# EAGLE design usbrelay (EAGLE 6.0)
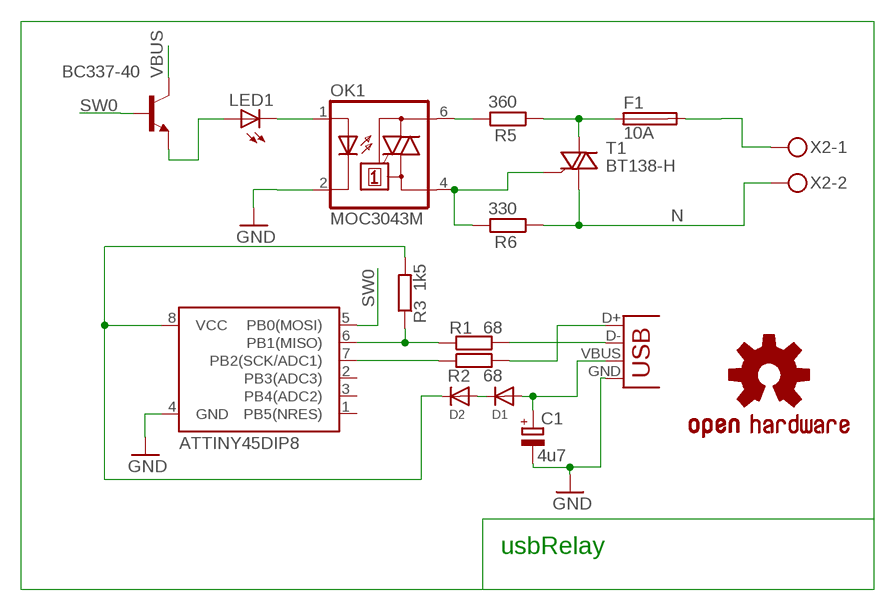
[diagram p0: schematic, sheet 1]

## Parts
C1  4u7  CPOL-EUE5-4  [E5-4]
D1  DIODEDO-1N4148  [DO-1N4148]
D2  DIODEDO-1N4148  [DO-1N4148]
F1  10A  FUSEBLANK_5X20MM  [FUSE_HOLDER_5X20MM]
LED1  LED3MM  [LED3MM]
OK1  MOC3043M  [DIL06]
Q1  BC337-40  [TO92]
R1  68  R-EU_0204/5  [0204/5]
R2  68  R-EU_0204/5  [0204/5]
R3  1k5  R-EU_0204/5  [0204/5]
R5  360  R-EU_0204/5  [0204/5]
R6  330  R-EU_0204/5  [0204/5]
T1  BT138-H  [TO220BH]
U$1  ATTINY45DIP8  [DIP08]
U$2  OSHW-LOGOM  [OSHW-LOGO-M]
X1  USBPTH  [USB-B-PTH]
X2  MKDSN1,5/2-5,08  [MKDSN1,5/2-5,08]

## Nets
GND: C1.- U$1.4(GND) X1.GND
N [hw]: R6.1 T1.T1(A1) X2.2
N$1: D1.C D2.A
N$2: R1.2 X1.D-
N$3: R1.1 R3.1 U$1.6(PB1(MISO))
N$4: R2.2 X1.D+
N$6: R2.1 U$1.7(PB2(SCK/ADC1))
N$7: LED1.A Q1.1(E)
N$8: D2.C R3.2 U$1.8(VCC)
N$9: Q1.2(B)
N$14: LED1.K(C) OK1.1(A)
N$17: OK1.2(C)
N$18 [hw]: OK1.6(A2) R5.2
N$20 [hw]: F1.1 R5.1 T1.T2(A2)
N$21 [hw]: OK1.4(A1) R6.2 T1.G
N$24 [hw]: F1.2 X2.1
SW0: U$1.5(PB0(MOSI))
VBUS: C1.+ D1.A Q1.3(C) X1.VBUS
Unconnected: U$1.1(PB5(NRES)) U$1.2(PB3(ADC3)) U$1.3(PB4(ADC2))

## Notes on the sheet
- usbRelay

## Library data of the parts
C1 = resistor:CPOL-EU: POLARIZED CAPACITOR, European symbol
D1 D2 = adafruit:DIODE: Diode SMADIODE - SMA Surface Mount Package 20V 1A Schottky Diode Digikey: 641-1014-6-ND DO-1N4148 - Through Hole Small Current Diode SOD-123 20V 1 A (.5mV Vf) Schottky Diode - Digikey: MBRX120TPMSCT-ND SOD-323 10V 570mA (.38mV Vf, 3ns) Schottky Diode - Digikey: ZLLS410CT-ND SOD-523 30V 30mA Schottky Diode (RB751S-40TE61) - Digikey: RB751S-40TE61CT-ND SOT23-R/W - SOT23 Package (R = Solder Paste/Reflow Ovens, W = Hand-Soldering) BAT54Film 40V 300mA - Digikey: 497-7162-1-ND
F1 = fuse:FUSE: Fuse
LED1 = adafruit:LED: LED OSRAM: - CHIPLED LG R971, LG N971, LY N971, LG Q971, LY Q971, LO R971, LY R971 LH N974, LH R974 LS Q976, LO Q976, LY Q976 LO Q996 - Hyper CHIPLED LW Q18S LB Q993, LB Q99A, LB R99A - SideLED LS A670, LO A670, LY A670, LG A670, LP A670 LB A673, LV A673, LT A673, LW A673 LH A674 LY A675 LS A676, LA A676, LO A676, LY A676, LW A676 LS A679, LY A679, LG A679 - Hyper Micro SIDELED® LS Y876, LA Y876, LO Y876, LY Y876 LT Y87S - SmartLED LW L88C, LW L88S LB L89C, LB L89S, LG L890 LS L89K, LO L89K, LY L89K LS L896, LA L896, LO L896, LY L896 - TOPLED LS T670, LO T670, LY T670, LG T670, LP T670 LSG T670, LSP T670, LSY T670, LOP T670, LYG T670 LG T671, LOG T671, LSG T671 LB T673, LV T673, LT T673, LW T673 LH T674 LS T676, LA T676, LO T676, LY T676, LB T676, LH T676, LSB T676, LW T676 LB T67C, LV T67C, LT T67C, LS T67K, LO T67K, LY T67K, LW E67C LS E67B, LA E67B, LO E67B, LY E67B, LB E67C, LV E67C, LT E67C LW T67C LS T679, LY T679, LG T679 LS T770, LO T770, LY T770, LG T770, LP T770 LB T773, LV T773, LT T773, LW T773 LH T774 LS E675, LA E675, LY E675, LS T675 LS T776, LA T776, LO T776, LY T776, LB T776 LHGB T686 LT T68C, LB T68C - Hyper Mini TOPLED® LB M676 - Mini TOPLED Santana® LG M470 LS M47K, LO M47K, LY M47K Source: http://www.osram.convergy.de/
OK1 = optocoupler:MOC30*: 6-Pin DIP Zero-Cross Optoisolators Triac Driver Output (250/400 Volt Peak) Source: http://www.fairchildsemi.com/ds/MO/MOC3043-M.pdf
Q1 = transistor-npn:BC337*: NPN Transistor
R1-R3 R5 R6 = resistor:R-EU_: RESISTOR, European symbol
T1 = triac:BT138: TRIAC Source: http://www.semiconductors.philips.com BT138_SERIES_2.pdf
U$1 = SparkFun:ATTINY45: Atmel ATTiny45
U$2 = SparkFun:OSHW-LOGO: Open Source Hardware Logo This logo indicates the piece of hardware it is found on incorporates a OSHW license and/or adheres to the definition of open source hardware found here: http://freedomdefined.org/OSHW
X1 = SparkFun:USB: USB Connectors USB-B-PTH is fully proven SKU : PRT-00139 USB-miniB is fully proven SKU : PRT-00587 USB-A-PCB is untested. USB-A-H is throughly reviewed, but untested. Spark Fun Electronics SKU : PRT-00437 USB-B-SMT is throughly reviewed, but untested. Needs silkscreen touching up. USB-A-S has not been used/tested USB-MB-H has not been used/tested
X2 = con-phoenix-508:MKDSN1,5/2-5,08: MKDSN 1,5/ 2-5,08 Printklemme Nennstrom: 13,5 A Nennspannung: 250 V Rastermaß: 5,08 mm Polzahl: 2 Anschlussart: Schraubanschluss Montage: Löten Anschlussrichtung Leiter/Platine: 0 ° Artikelnummer: 1729128 Source: http://eshop.phoenixcontact.com .. 1729128.pdf; MPN: MKDSN 1,5/2-5.08; OC_FARNELL: 1792903; OC_NEWARK: 30M2397

## Net classes
0 default: width 0.3 mm
1 hw: width 1.5 mm

## Board
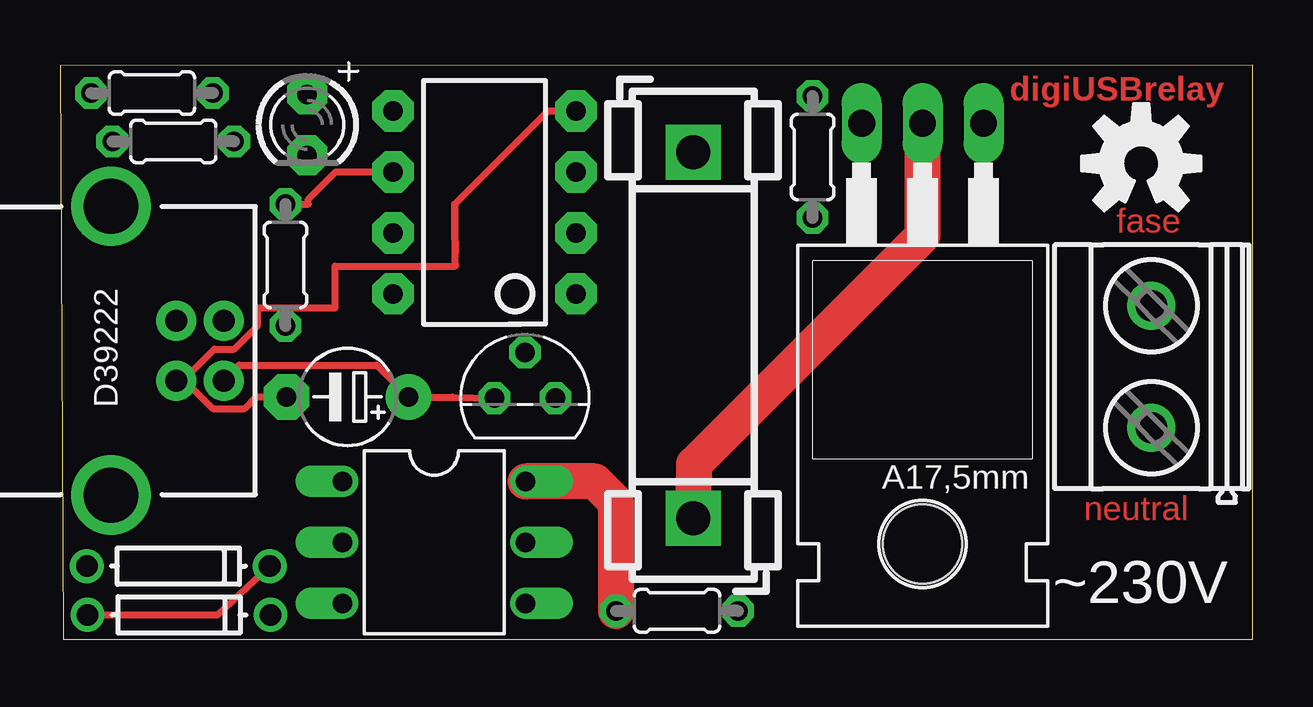
[diagram p1: board, top side]
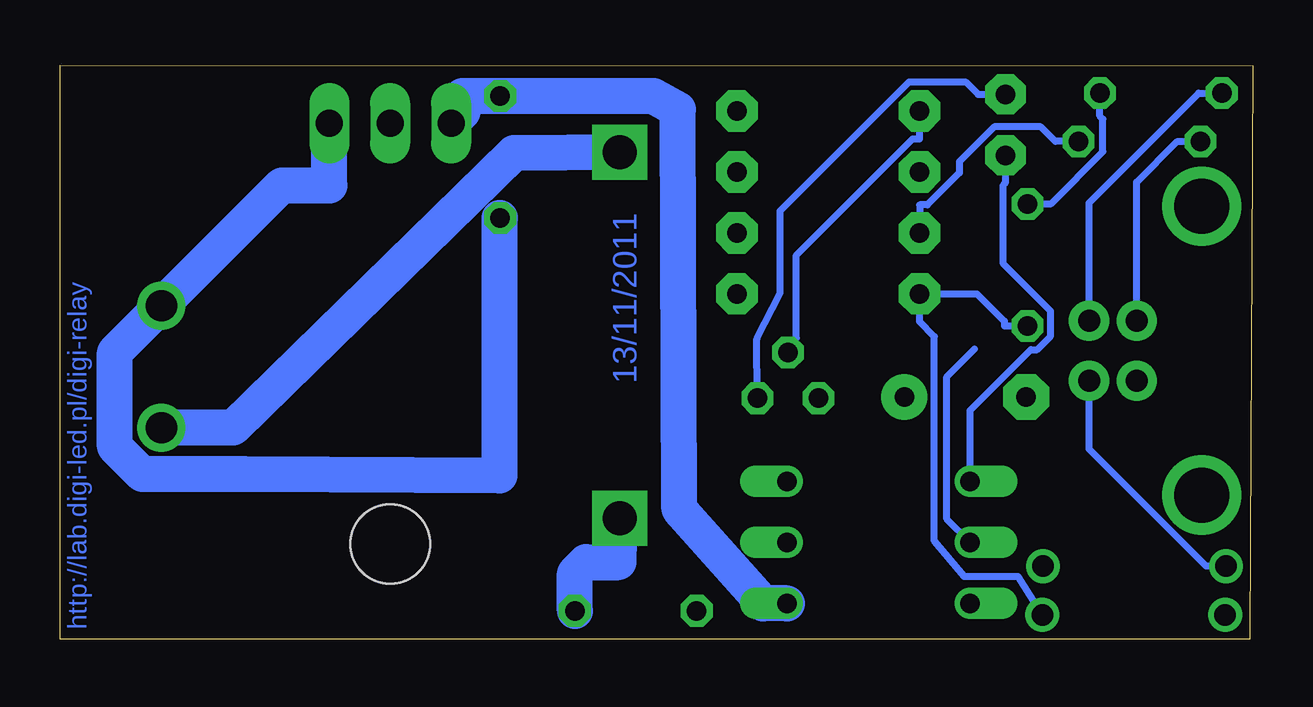
[diagram p2: board, bottom side, seen from below]

Size 49.7 x 23.91 mm. Coordinates in mm from the lower left corner, seen from the top.
Outline: 0.13,0 49.7,0 49.7,23.91 0,23.89 0.13,0
Copper layers (1*16): Top 0.035mm / dielectric 1.5mm / Bottom 0.035mm
Design rules: minimum track width 6mil, minimum drill 12mil, track to track 6mil, track to pad 6mil, pad to pad 6mil, via to via 6mil, smd to smd 0mil, copper to edge 10mil, drill to drill 10mil, minimum pad ring 10mil, minimum via ring 6mil, stop-mask expansion 2mil, vias tented up to drill 100mil, thermal gap 10mil

### Footprints (pad centres in the part's own frame; a part is rotated, then mirrored left to right if it is on the bottom)
E5-4 = drill 0.813 pad 1.905: + -2.54,0 | drill 0.813 pad 1.905 octagon: - 2.54,0
DO-1N4148 = drill 0.9: A -3.81,0; C 3.81,0
FUSE_HOLDER_5X20MM = drill 1.422 pad 2.286 square: 1 0,0; 2 15.24,0
LED3MM = drill 0.813 pad 1.676 octagon: A -1.27,0; K 1.27,0
DIL06 = drill 0.813 offset: 1 -2.54,-3.81; 2 0,-3.81; 3 2.54,-3.81; 4 2.54,3.81; 5 0,3.81; 6 -2.54,3.81
TO92 = drill 0.813 octagon: 1 1.27,0; 2 0,1.905; 3 -1.27,0
0204/5 = drill 0.813 octagon: 1 -2.54,0; 2 2.54,0
TO220BH = drill 1.118 long: G 2.54,-6.35; T1 -2.54,-6.35; T2 0,-6.35 | hole 3.302: 0,11.176
DIP08 = drill 0.813 pad 1.727 octagon: 1 -3.81,-3.81; 2 -1.27,-3.81; 3 1.27,-3.81; 4 3.81,-3.81; 5 3.81,3.81; 6 1.27,3.81; 7 -1.27,3.81; 8 -3.81,3.81
USB-B-PTH = drill 0.914 pad 1.676: D+ 0,1.25; D- 1.981,1.25; GND 0,-1.25; VBUS 1.981,-1.25 | drill 2.286: S1 -2.718,-6.02; S2 -2.718,6.02
MKDSN1,5/2-5,08 = drill 1.3 pad 2: 1 -2.561,0.025; 2 2.519,0.025

### Placement (x,y rotation side)
C1  11.98,10.09 180 top
D1  4.93,3.04 0 top
D2  4.96,1.01 0 top
F1  26.38,5.04 90 top
LED1  10.3,21.43 270 top
OK1  15.59,4.03 270 top
Q1  19.37,10.04 0 top
R1  3.83,22.75 180 top
R2  4.72,20.74 180 top
R3  9.39,15.59 270 top
R5  25.71,1.18 180 top
R6  31.36,20.09 90 top
T1  35.94,15.14 180 top
U$1  17.69,18.2 90 top
U$2  45.05,19.82 0 top
X1  4.84,12.02 0 top
X2  45.5,11.37 90 top

### Tracks (layer width: path | path; a pad name or v marks a point on that pad's centre or on a via)
GND
  Top 0.3: 5.15,10.8 6.35,9.6 7.69,9.6 8.19,10.09 C1.- | X1.GND 4.87,10.8 5.15,10.8 | 5.15,10.8 6.43,12.09 7.26,12.09 8.24,13.06 8.24,13.8 11.46,13.8 11.46,15.54 16.47,15.54 16.47,15.62 16.47,16.09 | U$1.4 20.33,22.01 16.45,18.13
  Top 0.305: 16.47,16.09 16.45,17.17 16.45,18.13
N
  Bottom 1.5: R6.1 31.38,17.55 31.38,6.81 42.04,6.87 46.27,6.87 47.41,8.02 47.41,11.95 X2.2 40.45,18.91 38.48,18.91 T1.T1
N$1
  Top 0.3: D2.A 6.57,1.01 D1.C
N$2
  Bottom 0.3: R1.2 2.25,22.75 6.82,18.18 X1.D-
N$3
  Top 0.3: R3.1 10.35,18.13 10.35,18.33 11.49,19.47 U$1.6
  Bottom 0.3: R1.1 6.37,21.79 6.25,21.67 6.25,20.31 8.43,18.13 R3.1
N$4
  Bottom 0.3: R2.2 3.14,20.74 4.84,19.04 X1.D+
N$6
  Bottom 0.3: R2.1 8.22,20.74 8.83,21.34 10.78,21.34 12.22,19.9 12.22,19.43 13.56,18.1 13.88,18.1 U$1.7
N$7
  Bottom 0.3: LED1.A 11.44,22.7 11.96,23.22 14.32,23.22 19.7,17.84 19.7,14.42 20.66,12.51 Q1.1
N$8
  Bottom 0.3: D2.C 9.78,2.6 12.02,2.6 13.27,4.08 13.27,12.61 13.88,13.22 U$1.8 11.49,14.39 10.35,13.25 10.35,13.05 R3.2
N$14
  Bottom 0.3: LED1.K 10.3,19.02 10.4,18.92 10.4,15.63 8.42,13.66 8.42,12.63 8.99,12.06 9.25,12.06 11.78,9.53 OK1.1
N$17
  Bottom 0.3: 11.6,12.09 12.75,10.94 12.75,5 OK1.2
N$18
  Top 1.5: OK1.6 22.28,6.57 23.17,5.68 R5.2
N$20
  Top 1.5: F1.1 26.42,7.29 35.94,16.82 T1.T2
  Bottom 1.5: F1.1 26.42,3.2 27.79,3.2 28.25,2.74 R5.1
N$21
  Bottom 1.5: T1.G 32.92,21.97 32.92,22.63 R6.2 24.98,22.63 23.95,22.06 23.89,5.42 20.4,1.49 OK1.4
N$24
  Bottom 1.5: X2.1 42.49,8.81 30.79,20.25 F1.2
SW0
  Bottom 0.3: 19.26,12.12 19.02,12.55 19.02,16 14.17,20.84 13.88,20.84 U$1.5
VBUS
  Top 0.3: X1.VBUS 7.47,11.41 13.2,11.41 C1.+ 14.56,10.08 16.36,10.08 Q1.3
  Bottom 0.3: X1.VBUS 6.82,7.92 1.94,3.04 D1.A

### Text on the board
Top: digiUSBrelay | fase | neutral
Bottom: 13/11/2011 | http://lab.digi-led.pl/digi-relay
tNames: D39222 | ~230V